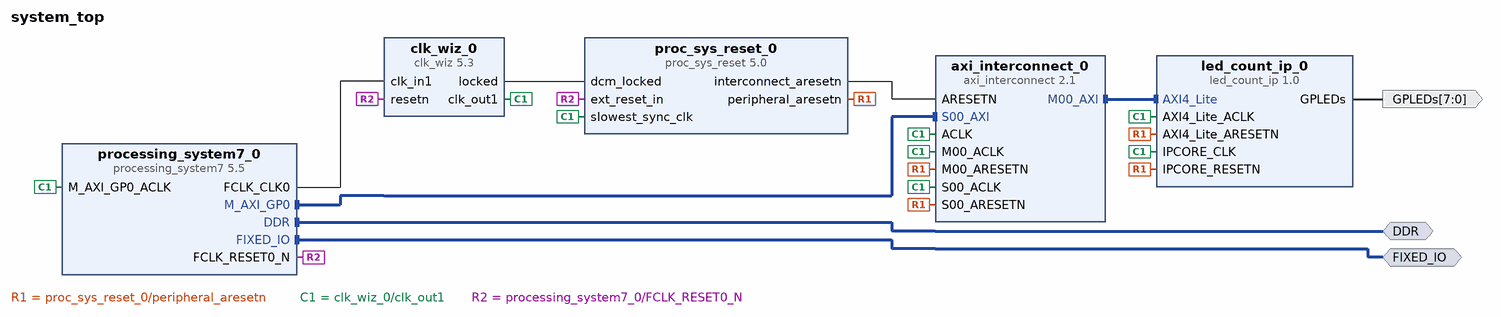
[diagram p0: block diagram of the top level]
# Vivado block design system_top, Vivado 2016.2
create_bd_design system_top

create_bd_intf_port -mode Master -vlnv xilinx.com:interface:ddrx_rtl:1.0 DDR
create_bd_intf_port -mode Master -vlnv xilinx.com:display_processing_system7:fixedio_rtl:1.0 FIXED_IO
create_bd_port -dir O -from 7 -to 0 GPLEDs

create_bd_cell -type ip -vlnv xilinx.com:ip:axi_interconnect:2.1 axi_interconnect_0
set_property -dict {CONFIG.NUM_MI 1} [get_bd_cells axi_interconnect_0]
create_bd_cell -type ip -vlnv xilinx.com:ip:clk_wiz:5.3 clk_wiz_0
set_property -dict [list \
  CONFIG.CLKOUT1_REQUESTED_OUT_FREQ 50.000 \
  CONFIG.RESET_PORT resetn \
  CONFIG.MMCM_DIVCLK_DIVIDE 1 \
  CONFIG.MMCM_CLKOUT0_DIVIDE_F 20.000 \
  CONFIG.RESET_TYPE ACTIVE_LOW \
  CONFIG.CLKOUT1_JITTER 151.636 \
] [get_bd_cells clk_wiz_0]
create_bd_cell -type ip -vlnv xilinx.com:ip:proc_sys_reset:5.0 proc_sys_reset_0
set_property -dict {CONFIG.C_AUX_RESET_HIGH 0} [get_bd_cells proc_sys_reset_0]
create_bd_cell -type ip -vlnv xilinx.com:ip:processing_system7:5.5 processing_system7_0
set_property -dict [list \
  CONFIG.PCW_SDIO_PERIPHERAL_FREQMHZ 50 \
  CONFIG.PCW_UART_PERIPHERAL_FREQMHZ 50 \
  CONFIG.PCW_FPGA0_PERIPHERAL_FREQMHZ 100 \
  CONFIG.PCW_M_AXI_GP0_FREQMHZ 10 \
  CONFIG.PCW_PERIPHERAL_BOARD_PRESET part0 \
  CONFIG.PCW_PRESET_BANK1_VOLTAGE {LVCMOS 1.8V} \
  CONFIG.PCW_UIPARAM_DDR_PARTNO {MT41J128M16 HA-15E} \
  CONFIG.PCW_QSPI_PERIPHERAL_ENABLE 1 \
  CONFIG.PCW_QSPI_QSPI_IO {MIO 1 .. 6} \
  CONFIG.PCW_QSPI_GRP_SINGLE_SS_ENABLE 1 \
  CONFIG.PCW_QSPI_GRP_SINGLE_SS_IO {MIO 1 .. 6} \
  CONFIG.PCW_QSPI_GRP_FBCLK_ENABLE 1 \
  CONFIG.PCW_QSPI_GRP_FBCLK_IO {MIO 8} \
  CONFIG.PCW_ENET0_PERIPHERAL_ENABLE 1 \
  CONFIG.PCW_ENET0_ENET0_IO {MIO 16 .. 27} \
  CONFIG.PCW_ENET0_GRP_MDIO_ENABLE 1 \
  CONFIG.PCW_ENET0_GRP_MDIO_IO {MIO 52 .. 53} \
  CONFIG.PCW_ENET0_RESET_ENABLE 0 \
  CONFIG.PCW_SD0_PERIPHERAL_ENABLE 1 \
  CONFIG.PCW_SD0_SD0_IO {MIO 40 .. 45} \
  CONFIG.PCW_SD0_GRP_CD_ENABLE 1 \
  CONFIG.PCW_SD0_GRP_CD_IO {MIO 47} \
  CONFIG.PCW_SD0_GRP_WP_ENABLE 1 \
  CONFIG.PCW_SD0_GRP_WP_IO {MIO 46} \
  CONFIG.PCW_UART1_PERIPHERAL_ENABLE 1 \
  CONFIG.PCW_UART1_UART1_IO {MIO 48 .. 49} \
  CONFIG.PCW_TTC0_PERIPHERAL_ENABLE 1 \
  CONFIG.PCW_TTC0_TTC0_IO EMIO \
  CONFIG.PCW_USB0_PERIPHERAL_ENABLE 1 \
  CONFIG.PCW_USB0_USB0_IO {MIO 28 .. 39} \
  CONFIG.PCW_USB0_RESET_ENABLE 0 \
  CONFIG.PCW_GPIO_MIO_GPIO_ENABLE 1 \
  CONFIG.PCW_GPIO_MIO_GPIO_IO MIO \
  CONFIG.preset ZedBoard \
] [get_bd_cells processing_system7_0]
# 195 more settings of processing_system7_0 are not shown: defaults, MIO pin electricals, DDR timing, and values the tool derives
create_bd_cell -type ip -vlnv xilinx.com:ip:led_count_ip:1.0 led_count_ip_0

# ---- connections ----

connect_bd_intf_net [get_bd_intf_pins axi_interconnect_0/S00_AXI] [get_bd_intf_pins processing_system7_0/M_AXI_GP0]
connect_bd_intf_net [get_bd_intf_pins led_count_ip_0/AXI4_Lite] [get_bd_intf_pins axi_interconnect_0/M00_AXI]
connect_bd_intf_net [get_bd_intf_ports DDR] [get_bd_intf_pins processing_system7_0/DDR]
connect_bd_intf_net [get_bd_intf_ports FIXED_IO] [get_bd_intf_pins processing_system7_0/FIXED_IO]
connect_bd_net -net ARESETN_1 [get_bd_pins proc_sys_reset_0/interconnect_aresetn] [get_bd_pins axi_interconnect_0/ARESETN]
connect_bd_net -net S00_ARESETN_1 [get_bd_pins proc_sys_reset_0/peripheral_aresetn] \
  [get_bd_pins led_count_ip_0/AXI4_Lite_ARESETN] [get_bd_pins led_count_ip_0/IPCORE_RESETN] \
  [get_bd_pins axi_interconnect_0/M00_ARESETN] [get_bd_pins axi_interconnect_0/S00_ARESETN]
connect_bd_net [get_bd_pins clk_wiz_0/clk_out1] \
  [get_bd_pins proc_sys_reset_0/slowest_sync_clk] [get_bd_pins processing_system7_0/M_AXI_GP0_ACLK] \
  [get_bd_pins led_count_ip_0/AXI4_Lite_ACLK] [get_bd_pins led_count_ip_0/IPCORE_CLK] [get_bd_pins axi_interconnect_0/ACLK] \
  [get_bd_pins axi_interconnect_0/M00_ACLK] [get_bd_pins axi_interconnect_0/S00_ACLK]
connect_bd_net -net clk_wiz_1_locked [get_bd_pins clk_wiz_0/locked] [get_bd_pins proc_sys_reset_0/dcm_locked]
connect_bd_net [get_bd_pins processing_system7_0/FCLK_CLK0] [get_bd_pins clk_wiz_0/clk_in1]
connect_bd_net [get_bd_pins processing_system7_0/FCLK_RESET0_N] [get_bd_pins clk_wiz_0/resetn] [get_bd_pins proc_sys_reset_0/ext_reset_in]
connect_bd_net [get_bd_pins led_count_ip_0/GPLEDs] [get_bd_ports GPLEDs]

# ---- address map ----
assign_bd_address -offset 0x400D0000 -range 64K -target_address_space [get_bd_addr_spaces processing_system7_0/Data] [get_bd_addr_segs led_count_ip_0/AXI4_Lite/reg0]

validate_bd_design
save_bd_design
